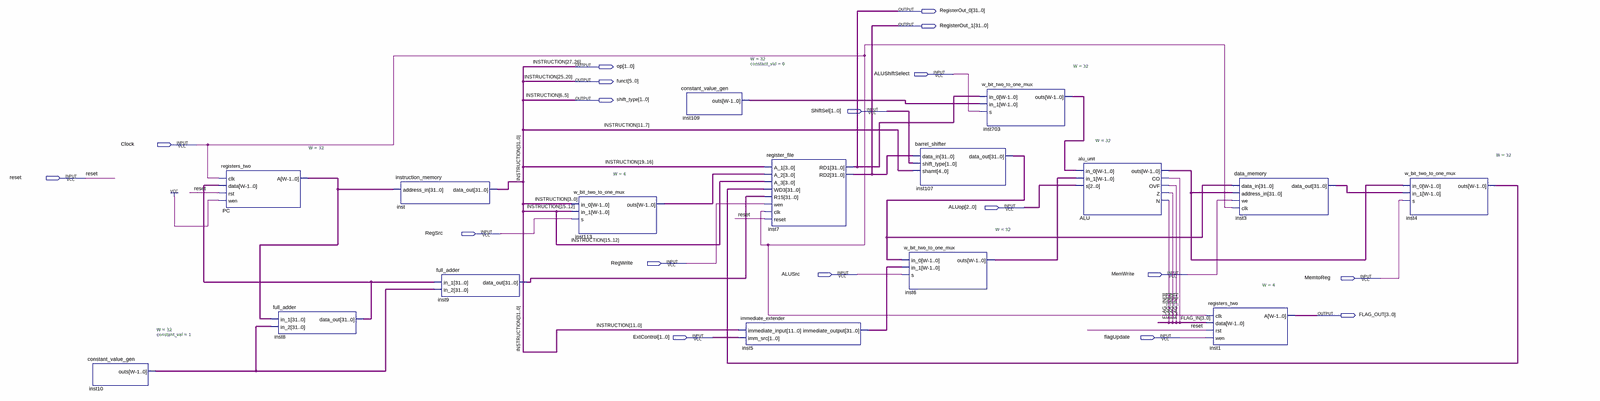
[diagram p0: schematic sheet, whole]
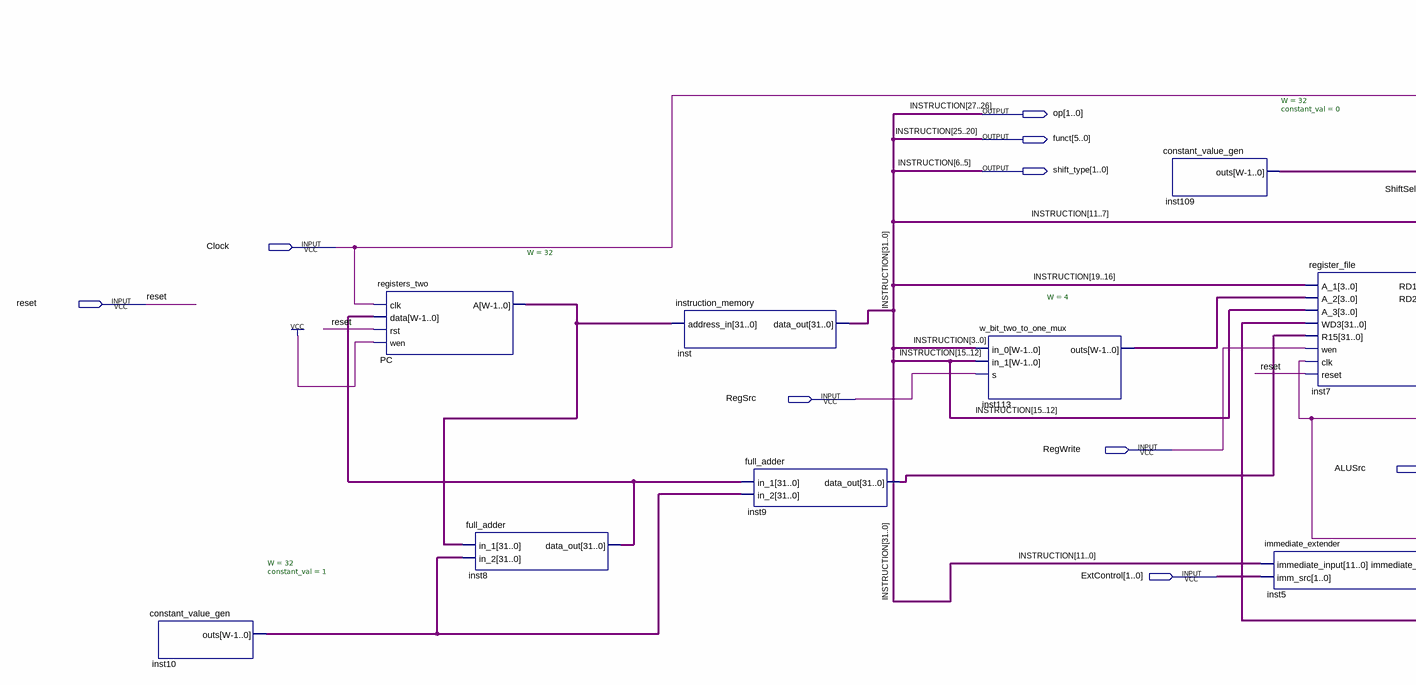
[diagram p1: schematic sheet, left part]
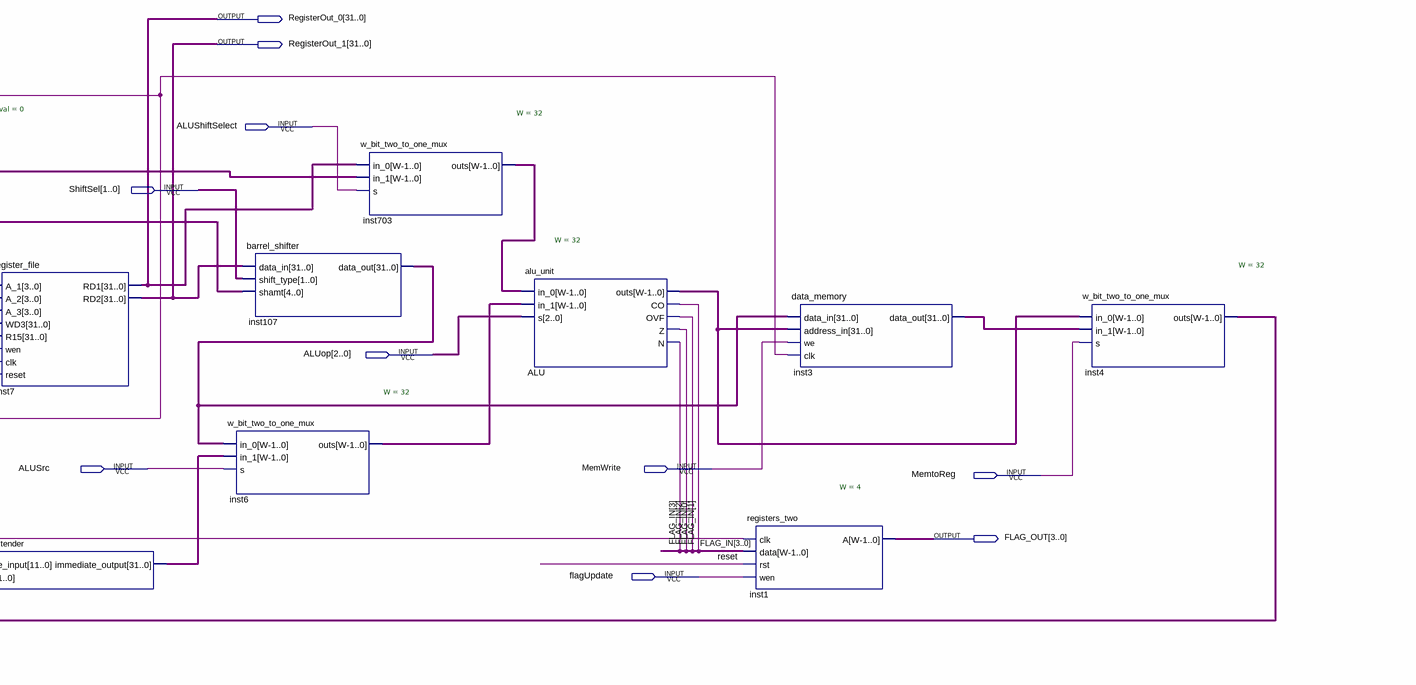
[diagram p2: schematic sheet, right part]
// Quartus schematic single_cycle_computer_datapath.bdf as structural Verilog: 16 symbols, 18 pins
module single_cycle_computer_datapath (
  input  ALUShiftSelect,
  input  [1:0] ShiftSel,
  input  Clock,
  input  reset,
  input  [2:0] ALUop,
  input  RegSrc,
  input  RegWrite,
  input  ALUSrc,
  input  MemWrite,
  input  MemtoReg,
  input  [1:0] ExtControl,
  input  flagUpdate,
  output [31:0] RegisterOut_0,
  output [31:0] RegisterOut_1,
  output [1:0] op,
  output [5:0] funct,
  output [1:0] shift_type,
  output [3:0] FLAG_OUT
);

  wire [3:0] FLAG_IN, inst113_outs;
  wire [31:0] ALU_outs, inst3_data_out, inst4_outs, inst5_immediate_output, inst6_outs, inst8_data_out,
       inst9_data_out, inst10_outs, inst107_data_out, inst109_outs, inst703_outs, INSTRUCTION, PC_a;

  constant_value_gen #(.W(32), .constant_val(1)) inst10 (.outs(inst10_outs));
  registers_two #(.W(32)) PC (.clk(Clock), .data(inst8_data_out), .rst(reset), .wen(1'b1), .A(PC_a));
  full_adder inst8 (.in_1(PC_a), .in_2(inst10_outs), .data_out(inst8_data_out));
  instruction_memory inst (
    .address_in(PC_a),
    .data_out({INSTRUCTION[31:28], op, funct, INSTRUCTION[19:7], shift_type, INSTRUCTION[4:0]}));
  full_adder inst9 (.in_1(inst8_data_out), .in_2(inst10_outs), .data_out(inst9_data_out));
  w_bit_two_to_one_mux #(.W(4)) inst113 (
    .in_0(INSTRUCTION[3:0]), .in_1(INSTRUCTION[15:12]), .s(RegSrc), .outs(inst113_outs));
  constant_value_gen #(.W(32), .constant_val(0)) inst109 (.outs(inst109_outs));
  register_file inst7 (
    .A_1(INSTRUCTION[19:16]), .A_2(inst113_outs), .A_3(INSTRUCTION[15:12]), .WD3(inst4_outs),
    .R15(inst9_data_out), .wen(RegWrite), .clk(Clock), .reset(reset), .RD1(RegisterOut_0), .RD2(RegisterOut_1));
  immediate_extender inst5 (
    .immediate_input({INSTRUCTION[11:7], shift_type, INSTRUCTION[4:0]}), .imm_src(ExtControl),
    .immediate_output(inst5_immediate_output));
  barrel_shifter inst107 (
    .data_in(RegisterOut_1), .shift_type(ShiftSel), .shamt(INSTRUCTION[11:7]), .data_out(inst107_data_out));
  w_bit_two_to_one_mux #(.W(32)) inst6 (
    .in_0(inst107_data_out), .in_1(inst5_immediate_output), .s(ALUSrc), .outs(inst6_outs));
  w_bit_two_to_one_mux #(.W(32)) inst703 (
    .in_0(RegisterOut_0), .in_1(inst109_outs), .s(ALUShiftSelect), .outs(inst703_outs));
  alu_unit #(.W(32)) ALU (
    .in_0(inst703_outs), .in_1(inst6_outs), .s(ALUop), .outs(ALU_outs), .CO(FLAG_IN[1]), .OVF(FLAG_IN[0]),
    .Z(FLAG_IN[2]), .N(FLAG_IN[3]));
  registers_two #(.W(4)) inst1 (.clk(Clock), .data(FLAG_IN), .rst(reset), .wen(flagUpdate), .A(FLAG_OUT));
  data_memory inst3 (
    .data_in(inst107_data_out), .address_in(ALU_outs), .we(MemWrite), .clk(Clock), .data_out(inst3_data_out));
  w_bit_two_to_one_mux #(.W(32)) inst4 (.in_0(ALU_outs), .in_1(inst3_data_out), .s(MemtoReg), .outs(inst4_outs));

  // Other names for the same wires on the sheet: INSTRUCTION (some bits) = {op, funct, shift_type}
endmodule
